# Altium schematic sheet JTAG.SchDoc
size A4
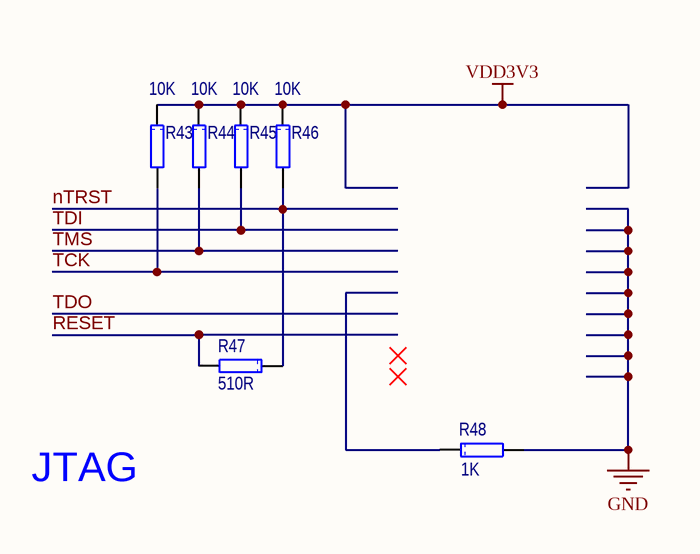
[diagram p0: JTAG.SchDoc]

## Parts
R43  10K  [1608[0603]R]
R44  10K  [1608[0603]R]
R45  10K  [1608[0603]R]
R46  10K  [1608[0603]R]
R47  510R  [1608[0603]R]
R48  1K

## Nets
GND: R48.2
VDD3V3: R43.1 R44.1 R45.1 R46.1
nTRST: R46.2 R47.1
RESET: R47.2
TCK: R43.2
TDI: R45.2
TMS: R44.2

Not connected (* = marked no-connect by the designer): R48 1

## Notes on the sheet
- JTAG

## Library data of the parts
R43-R46 = RES: Manufacturer: vishay; Model: CRCW060310K0KKEDTR; Parameters: 50V 1/10W 0.5%; Type: 无铅电阻; Value: 10K
R47 = RES: Manufacturer: vishay; Model: RT0603DRD7D510RL; Value: 510R; Type: 无铅电阻
R48 = RES: Manufacturer: vishay; Model: CRCW06031K0KKEDTR; Value: 1K; Type: 无铅电阻